# EAGLE design AL60 (EAGLE 5.11)
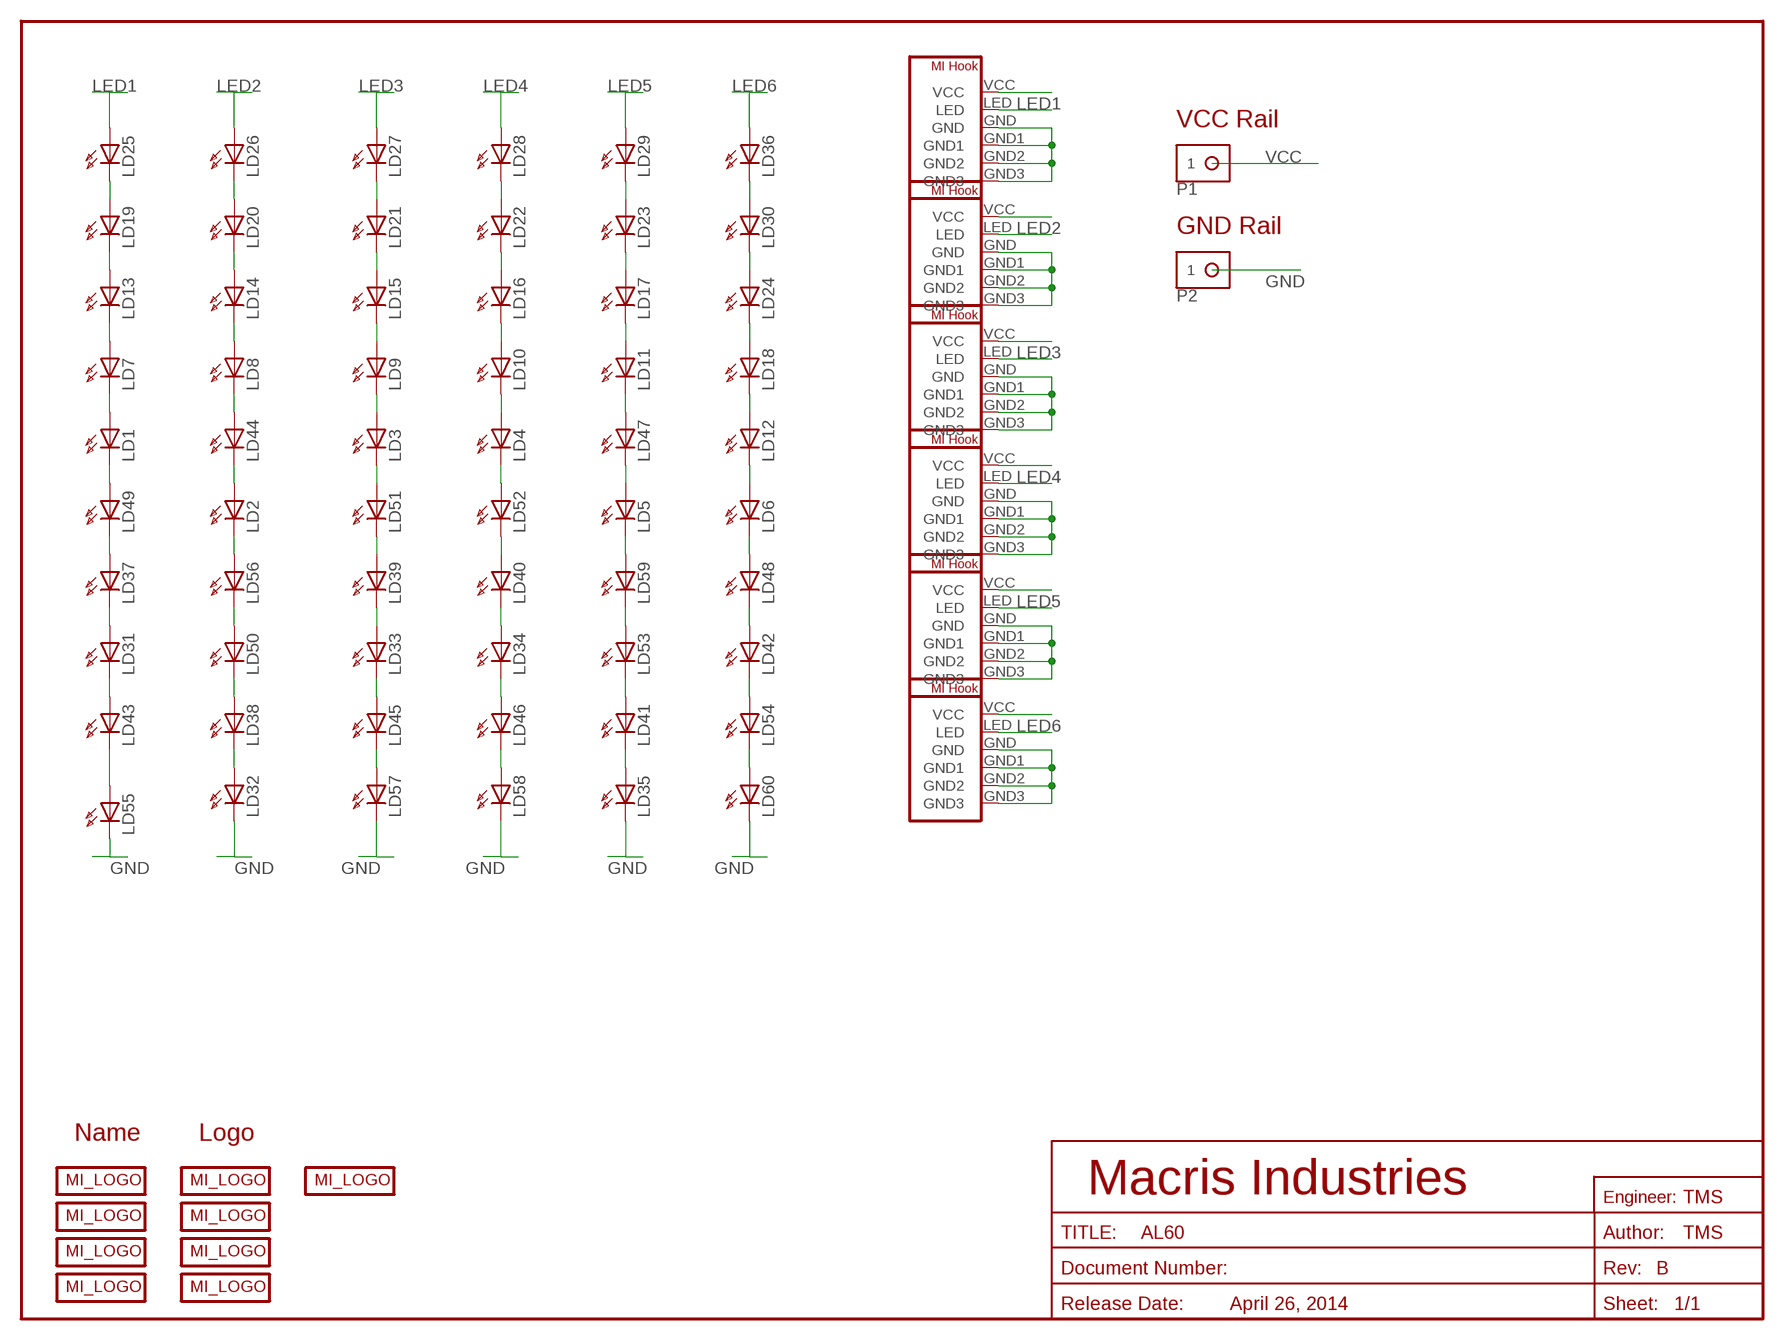
[diagram p0: schematic, sheet 1]

## Parts
LD1  LED-DS_XHB  [DS_XHB]
LD2  LED-DS_XHB  [DS_XHB]
LD3  LED-DS_XHB  [DS_XHB]
LD4  LED-DS_XHB  [DS_XHB]
LD5  LED-DS_XHB  [DS_XHB]
LD6  LED-DS_XHB  [DS_XHB]
LD7  LED-DS_XHB  [DS_XHB]
LD8  LED-DS_XHB  [DS_XHB]
LD9  LED-DS_XHB  [DS_XHB]
LD10  LED-DS_XHB  [DS_XHB]
LD11  LED-DS_XHB  [DS_XHB]
LD12  LED-DS_XHB  [DS_XHB]
LD13  LED-DS_XHB  [DS_XHB]
LD14  LED-DS_XHB  [DS_XHB]
LD15  LED-DS_XHB  [DS_XHB]
LD16  LED-DS_XHB  [DS_XHB]
LD17  LED-DS_XHB  [DS_XHB]
LD18  LED-DS_XHB  [DS_XHB]
LD19  LED-DS_XHB  [DS_XHB]
LD20  LED-DS_XHB  [DS_XHB]
LD21  LED-DS_XHB  [DS_XHB]
LD22  LED-DS_XHB  [DS_XHB]
LD23  LED-DS_XHB  [DS_XHB]
LD24  LED-DS_XHB  [DS_XHB]
LD25  LED-DS_XHB  [DS_XHB]
LD26  LED-DS_XHB  [DS_XHB]
LD27  LED-DS_XHB  [DS_XHB]
LD28  LED-DS_XHB  [DS_XHB]
LD29  LED-DS_XHB  [DS_XHB]
LD30  LED-DS_XHB  [DS_XHB]
LD31  LED-DS_XHB  [DS_XHB]
LD32  LED-DS_XHB  [DS_XHB]
LD33  LED-DS_XHB  [DS_XHB]
LD34  LED-DS_XHB  [DS_XHB]
LD35  LED-DS_XHB  [DS_XHB]
LD36  LED-DS_XHB  [DS_XHB]
LD37  LED-DS_XHB  [DS_XHB]
LD38  LED-DS_XHB  [DS_XHB]
LD39  LED-DS_XHB  [DS_XHB]
LD40  LED-DS_XHB  [DS_XHB]
LD41  LED-DS_XHB  [DS_XHB]
LD42  LED-DS_XHB  [DS_XHB]
LD43  LED-DS_XHB  [DS_XHB]
LD44  LED-DS_XHB  [DS_XHB]
LD45  LED-DS_XHB  [DS_XHB]
LD46  LED-DS_XHB  [DS_XHB]
LD47  LED-DS_XHB  [DS_XHB]
LD48  LED-DS_XHB  [DS_XHB]
LD49  LED-DS_XHB  [DS_XHB]
LD50  LED-DS_XHB  [DS_XHB]
LD51  LED-DS_XHB  [DS_XHB]
LD52  LED-DS_XHB  [DS_XHB]
LD53  LED-DS_XHB  [DS_XHB]
LD54  LED-DS_XHB  [DS_XHB]
LD55  LED-DS_XHB  [DS_XHB]
LD56  LED-DS_XHB  [DS_XHB]
LD57  LED-DS_XHB  [DS_XHB]
LD58  LED-DS_XHB  [DS_XHB]
LD59  LED-DS_XHB  [DS_XHB]
LD60  LED-DS_XHB  [DS_XHB]
P1  PAD-10G  [PAD_10G]
P2  PAD-10G  [PAD_10G]
U$1  MI_LOGO-50MIL  MI_LOGO-NAME_TWO  [MI_LOGO_NAME_2]
U$2  MI_LOGO-2014_USA  [MACRIS_USA_LOGO]
U$3  MI_LOGO-50MIL  MI_LOGO-NAME_TWO  [MI_LOGO_NAME_2]
U$4  MI_LOGO-2014_USA  [MACRIS_USA_LOGO]
U$5  MI_LOGO-50MIL  MI_LOGO-NAME_TWO  [MI_LOGO_NAME_2]
U$6  MI_LOGO-50MIL  MI_LOGO-NAME_TWO  [MI_LOGO_NAME_2]
U$7  MI_LOGO-2014_USA  [MACRIS_USA_LOGO]
U$8  MI_LOGO-2014_USA  [MACRIS_USA_LOGO]
U$9  MI_DRIVER_HOOKUP  [MI_DRIVE_HOOKUP]
U$10  MI_DRIVER_HOOKUP  [MI_DRIVE_HOOKUP]
U$11  MI_DRIVER_HOOKUP  [MI_DRIVE_HOOKUP]
U$12  MI_DRIVER_HOOKUP  [MI_DRIVE_HOOKUP]
U$13  MI_DRIVER_HOOKUP  [MI_DRIVE_HOOKUP]
U$14  MI_DRIVER_HOOKUP  [MI_DRIVE_HOOKUP]
U$15  MI_LOGO  [MACRIS_MIU30]

## Nets
GND: LD32.CATHODE(C) LD35.CATHODE(C) LD55.CATHODE(C) LD57.CATHODE(C) LD58.CATHODE(C) LD60.CATHODE(C) P2.1 U$9.GND U$9.GND1 U$9.GND2 U$9.GND3 U$10.GND U$10.GND1 U$10.GND2 U$10.GND3 U$11.GND U$11.GND1 U$11.GND2 U$11.GND3 U$12.GND U$12.GND1 U$12.GND2 U$12.GND3 U$13.GND U$13.GND1 U$13.GND2 U$13.GND3 U$14.GND U$14.GND1 U$14.GND2 U$14.GND3
LED1: LD25.ANODE(A) U$9.LED
LED2: LD26.ANODE(A) U$10.LED
LED3: LD27.ANODE(A) U$11.LED
LED4: LD28.ANODE(A) U$12.LED
LED5: LD29.ANODE(A) U$13.LED
LED6: LD36.ANODE(A) U$14.LED
N$1: LD13.ANODE(A) LD19.CATHODE(C)
N$2: LD7.ANODE(A) LD13.CATHODE(C)
N$3: LD1.ANODE(A) LD7.CATHODE(C)
N$4: LD1.CATHODE(C) LD49.ANODE(A)
N$5: LD37.ANODE(A) LD49.CATHODE(C)
N$6: LD31.ANODE(A) LD37.CATHODE(C)
N$7: LD31.CATHODE(C) LD43.ANODE(A)
N$8: LD43.CATHODE(C) LD55.ANODE(A)
N$10: LD23.ANODE(A) LD29.CATHODE(C)
N$11: LD17.ANODE(A) LD23.CATHODE(C)
N$12: LD20.ANODE(A) LD26.CATHODE(C)
N$13: LD14.ANODE(A) LD20.CATHODE(C)
N$14: LD8.ANODE(A) LD14.CATHODE(C)
N$15: LD8.CATHODE(C) LD44.ANODE(A)
N$16: LD2.ANODE(A) LD44.CATHODE(C)
N$17: LD2.CATHODE(C) LD56.ANODE(A)
N$18: LD50.ANODE(A) LD56.CATHODE(C)
N$19: LD38.ANODE(A) LD50.CATHODE(C)
N$20: LD32.ANODE(A) LD38.CATHODE(C)
N$24: LD33.CATHODE(C) LD45.ANODE(A)
N$25: LD21.ANODE(A) LD27.CATHODE(C)
N$26: LD15.ANODE(A) LD21.CATHODE(C)
N$27: LD9.ANODE(A) LD15.CATHODE(C)
N$28: LD3.ANODE(A) LD9.CATHODE(C)
N$29: LD3.CATHODE(C) LD51.ANODE(A)
N$30: LD39.ANODE(A) LD51.CATHODE(C)
N$31: LD33.ANODE(A) LD39.CATHODE(C)
N$32: LD45.CATHODE(C) LD57.ANODE(A)
N$33: LD11.ANODE(A) LD17.CATHODE(C)
N$34: LD11.CATHODE(C) LD47.ANODE(A)
N$35: LD30.ANODE(A) LD36.CATHODE(C)
N$36: LD22.ANODE(A) LD28.CATHODE(C)
N$37: LD16.ANODE(A) LD22.CATHODE(C)
N$38: LD10.ANODE(A) LD16.CATHODE(C)
N$39: LD4.ANODE(A) LD10.CATHODE(C)
N$40: LD34.ANODE(A) LD40.CATHODE(C)
N$41: LD34.CATHODE(C) LD46.ANODE(A)
N$42: LD46.CATHODE(C) LD58.ANODE(A)
N$43: LD4.CATHODE(C) LD52.ANODE(A)
N$46: LD40.ANODE(A) LD52.CATHODE(C)
N$47: LD5.ANODE(A) LD47.CATHODE(C)
N$48: LD5.CATHODE(C) LD59.ANODE(A)
N$49: LD53.ANODE(A) LD59.CATHODE(C)
N$50: LD41.ANODE(A) LD53.CATHODE(C)
N$51: LD35.ANODE(A) LD41.CATHODE(C)
N$52: LD24.ANODE(A) LD30.CATHODE(C)
N$53: LD18.ANODE(A) LD24.CATHODE(C)
N$54: LD12.ANODE(A) LD18.CATHODE(C)
N$55: LD6.ANODE(A) LD12.CATHODE(C)
N$56: LD6.CATHODE(C) LD48.ANODE(A)
N$57: LD42.ANODE(A) LD48.CATHODE(C)
N$58: LD42.CATHODE(C) LD54.ANODE(A)
N$59: LD54.CATHODE(C) LD60.ANODE(A)
N$60: LD19.ANODE(A) LD25.CATHODE(C)
VCC: P1.1 U$9.VCC U$10.VCC U$11.VCC U$12.VCC U$13.VCC U$14.VCC

## Notes on the sheet
- VCC Rail
- GND Rail
- Name | Logo
- Macris Industries
- TMS
- TMS
- B
- April 26, 2014

## Library data of the parts
LD1-LD60 = Discrete:LED: Discrete LED
P1 P2 = Mechanical:PAD: Solder Pads
U$1-U$8 U$15 = Logo:MI_LOGO
U$9-U$14 = Mechanical:MI_DRIVER_HOOKUP

## Board
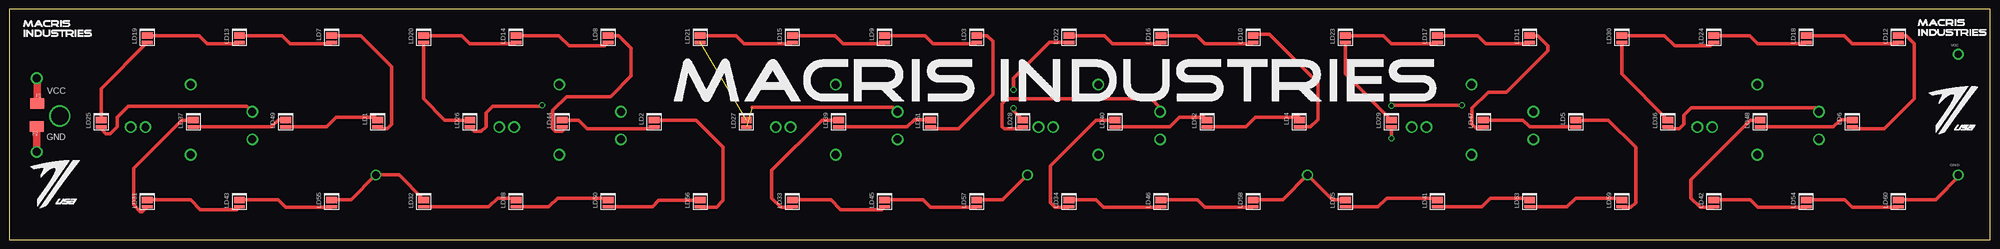
[diagram p1: board, top side]
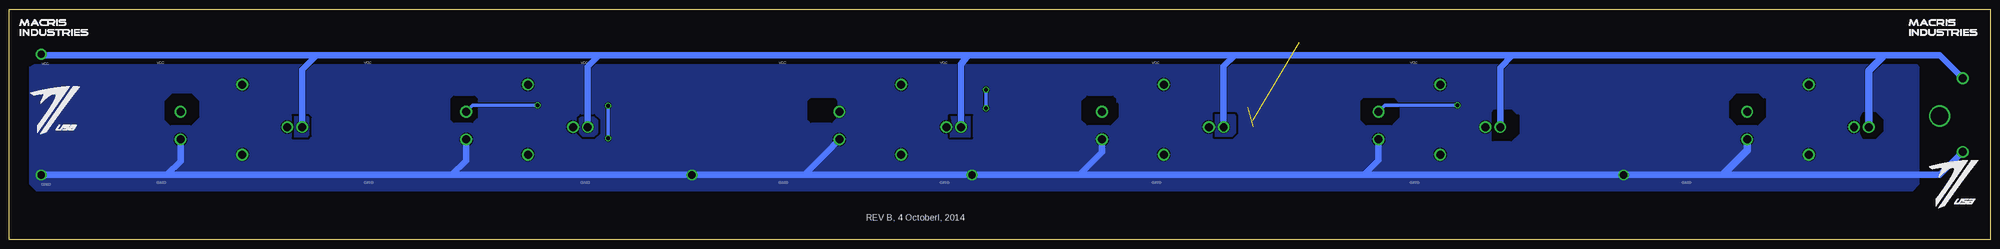
[diagram p2: board, bottom side, seen from below]

Size 546.1 x 63.5 mm. Coordinates in mm from the lower left corner, seen from the top.
Outline: 0,0 546.1,0 546.1,63.5 0,63.5 0,0
Copper layers (1*16): Top 0.0356mm / dielectric 1.5011mm / Bottom 0.0356mm
Design rules "oshPark": minimum track width 6mil, minimum drill 13mil, track to track 6mil, track to pad 6mil, pad to pad 6mil, via to via 6mil, smd to smd 6mil, copper to edge 15mil, drill to drill 6mil, minimum pad ring 7mil, minimum via ring 7mil, stop-mask expansion 4mil, vias tented up to drill 0mil, thermal gap 10mil
bRestrict: 93 lines

### Footprints (pad centres in the part's own frame; a part is rotated, then mirrored left to right if it is on the bottom)
DS_XHB = smd 0.95 x 3: ANODE 0.725,0 | smd 1.85 x 3: CATHODE -1.175,0
PAD_10G = smd 3.81 x 2.921: 1 0,0
MI_DRIVE_HOOKUP = drill 2.2 round: GND 36.576,7.264; GND1 19.558,3.048; GND2 19.558,22.352; GND3 7.112,10.668; LED 36.576,14.884; VCC 3.048,10.668

### Placement (x,y rotation side)
LD1  101.6,31.75 270 top
LD2  177.8,31.75 270 top
LD3  266.7,55.02 270 top
LD4  355.6,31.75 270 top
LD5  431.8,31.75 270 top
LD6  508,31.75 270 top
LD7  88.9,55.02 270 top
LD8  165.1,55.02 270 top
LD9  241.3,55.02 270 top
LD10  342.9,55.02 270 top
LD11  419.1,55.02 270 top
LD12  520.7,55.02 270 top
LD13  63.5,55.02 270 top
LD14  139.7,55.02 270 top
LD15  215.9,55.02 270 top
LD16  317.5,55.02 270 top
LD17  393.7,55.02 270 top
LD18  495.3,55.02 270 top
LD19  38.1,55.02 270 top
LD20  114.3,55.02 270 top
LD21  190.5,55.02 270 top
LD22  292.1,55.02 270 top
LD23  368.3,55.02 270 top
LD24  469.9,55.02 270 top
LD25  25.4,31.75 270 top
LD26  127,31.75 270 top
LD27  203.2,31.75 270 top
LD28  279.4,31.75 270 top
LD29  381,31.75 270 top
LD30  444.5,55.02 270 top
LD31  38.1,9.75 270 top
LD32  114.3,9.75 270 top
LD33  215.9,9.75 270 top
LD34  292.1,9.75 270 top
LD35  368.3,9.75 270 top
LD36  457.2,31.75 270 top
LD37  50.8,31.75 270 top
LD38  139.7,9.75 270 top
LD39  228.6,31.75 270 top
LD40  304.8,31.75 270 top
LD41  393.7,9.75 270 top
LD42  469.9,9.75 270 top
LD43  63.5,9.75 270 top
LD44  152.4,31.75 270 top
LD45  241.3,9.75 270 top
LD46  317.5,9.75 270 top
LD47  406.4,31.75 270 top
LD48  482.6,31.75 270 top
LD49  76.2,31.75 270 top
LD50  165.1,9.75 270 top
LD51  254,31.75 270 top
LD52  330.2,31.75 270 top
LD53  419.1,9.75 270 top
LD54  495.3,9.75 270 top
LD55  88.9,9.75 270 top
LD56  190.5,9.75 270 top
LD57  266.7,9.75 270 top
LD58  342.9,9.75 270 top
LD59  444.5,9.75 270 top
LD60  520.7,9.75 270 top
P1  7.75,37.47 180 top
P2  7.62,31.11 0 top
U$1  3.56,55.63 0 top
U$2  528.32,27.94 0 top
U$3  525.78,55.88 0 top
U$4  541.02,27.94 0 bottom
U$5  22.86,55.88 0 bottom
U$6  543.56,55.88 0 bottom
U$7  5.08,7.62 0 top
U$8  17.78,7.62 0 bottom
U$9  30.48,20.32 0 top
U$10  132.08,20.32 0 top
U$11  208.28,20.32 0 top
U$12  280.67,20.32 0 top
U$13  383.54,20.32 0 top
U$14  462.28,20.32 0 top
U$15  182.88,37.47 0 top

### Tracks (layer width: path | path; a pad name or v marks a point on that pad's centre or on a via)
GND  (via drill 2, 2.2 pad 2.18)
  Top 1.016: LD55.CATHODE 94.24,10.93 v101.09,17.78 107.45,17.78 LD32.CATHODE | LD57.CATHODE 273.82,10.93 v280.67,17.78 | LD58.CATHODE 351.04,10.93 v357.89,17.78 364.74,10.93 LD35.CATHODE | LD60.CATHODE 530.99,10.93 537.85,17.78 v537.21,17.78
  Top 2.032: v7.62,24.13 P2.1
  Bottom 1.778: v7.62,24.13 13.97,17.78 73.91,17.78 | 73.91,17.78 v101.09,17.78 172.72,17.78 | 326.9,17.78 v280.67,17.78 251.08,17.78 | 326.9,17.78 v357.89,17.78 424.05,17.78 | 251.08,17.78 172.72,17.78 | 502.67,17.78 424.05,17.78 | 502.67,17.78 v537.21,17.78 | 73.91,17.78 73.41,18.29 | U$10.GND 168.66,21.84 172.72,17.78 | U$11.GND 244.86,24 251.08,17.78 | U$12.GND 321.06,23.62 326.9,17.78 | U$13.GND 420.12,21.72 424.05,17.78 | U$14.GND 498.86,21.59 502.67,17.78
  Bottom 2.032: U$9.GND 67.06,24.64 73.41,18.29
  pour Bottom: 20.32,48.26 19.68,47.62 19.68,15.24 21.59,13.34 538.48,13.34 540.38,15.24 540.38,47.62 539.12,48.26
LED1
  Top 1.016: U$9.LED 65.56,36.7 32.89,36.7 29.84,33.66 29.84,31.11 27.94,29.21 26.67,29.21 25.4,30.48 LD25.ANODE
LED2  (via drill 1.1)
  Top 1.016: v146.94,36.96 146.69,36.7 133.22,36.7 131.44,34.92 131.44,31.11 130.18,29.84 128.18,29.84 LD26.ANODE
  Bottom 1.016: v146.94,36.96 166.9,36.96 U$10.LED
LED3  (1 unrouted)
  Top 1.016: 204.72,36.45 243.61,36.45 U$11.LED
LED4
  Top 1.016: U$12.LED 317.25,36.32 314.83,38.73 274.95,38.73 273.69,37.47 273.69,31.11 274.32,30.48 278.86,30.48 LD28.ANODE
LED5  (via drill 1.1)
  Top 1.016: v400.43,36.96 381.51,36.96 v381,36.83 | v381,27.94 LD29.ANODE
  Bottom 1.016: v400.43,36.96 418.36,36.96 U$13.LED | v381,27.94 v381,36.83
LED6
  Top 1.016: U$14.LED 497.74,36.32 463.68,36.32 461.64,34.29 461.64,31.75 460.38,30.48 457.75,30.48 LD36.ANODE
N$1
  Top 1.016: LD19.CATHODE 52.39,56.19 54.61,53.98 63.18,53.98 LD13.ANODE
N$2
  Top 1.016: LD13.CATHODE 75.25,56.19 77.47,53.98 88.58,53.98 LD7.ANODE
N$3
  Top 1.016: LD7.CATHODE 96.84,56.19 105.41,47.62 105.41,31.75 104.14,30.48 102.14,30.48 LD1.ANODE
N$4
  Top 1.016: LD49.ANODE 87.54,31.02 90.17,33.66 100.87,33.66 LD1.CATHODE
N$5
  Top 1.016: LD37.ANODE 72.3,31.02 74.3,33.02 76.11,33.02 LD49.CATHODE
N$6
  Top 1.016: LD37.CATHODE 47.53,32.92 34.29,19.68 34.29,9.53 36.2,7.62 36.69,7.62 LD31.ANODE
N$7
  Top 1.016: LD31.CATHODE 50.03,10.93 52.7,8.26 62.73,8.26 LD43.ANODE
N$8
  Top 1.016: LD43.CATHODE 74.16,10.93 76.2,8.89 88.76,8.89 LD55.ANODE
N$10
  Top 1.016: LD23.ANODE 368.3,45.62 LD29.CATHODE
N$11
  Top 1.016: LD23.CATHODE 378.78,56.19 381,53.98 393.38,53.98 LD17.ANODE
N$12
  Top 1.016: LD26.CATHODE 120.11,32.92 114.3,38.73 LD20.ANODE
N$13
  Top 1.016: LD20.CATHODE 124.78,56.19 127,53.98 139.38,53.98 LD14.ANODE
N$14
  Top 1.016: LD14.CATHODE 151.45,56.19 154.31,53.34 164.15,53.34 LD8.ANODE
N$15
  Top 1.016: LD8.CATHODE 167.96,56.19 171.45,52.7 171.45,45.09 165.74,39.37 153.67,39.37 149.86,35.56 149.86,30.48 150.5,29.84 152.4,29.84 153.03,30.48 152.94,30.48 LD44.ANODE
N$16
  Top 1.016: LD44.CATHODE 156.94,32.92 159.38,30.48 177.25,30.48 LD2.ANODE
N$17
  Top 1.016: LD2.CATHODE 189.32,32.92 196.85,25.4 196.85,10.79 194.94,8.89 190.64,8.89 LD56.ANODE
N$18
  Top 1.016: LD50.ANODE 177.3,9.03 179.07,10.79 190.37,10.79 LD56.CATHODE
N$19
  Top 1.016: LD38.ANODE 148.73,9.03 151.13,11.43 164.6,11.43 LD50.CATHODE
N$20
  Top 1.016: LD32.ANODE 132.22,9.03 134.62,11.43 139.2,11.43 LD38.CATHODE
N$21  (via drill 4.83 pad 5.08)
  other vias: 13.97,34.04
N$24
  Top 1.016: LD33.CATHODE 226.56,10.93 229.24,8.26 240.53,8.26 LD45.ANODE
N$25  (1 unrouted)
N$26
  Top 1.016: LD21.CATHODE 200.35,56.19 202.56,53.98 215.58,53.98 LD15.ANODE
N$27
  Top 1.016: LD15.CATHODE 227.65,56.19 229.87,53.98 240.98,53.98 LD9.ANODE
N$28
  Top 1.016: LD9.CATHODE 252.42,56.19 254.63,53.98 266.38,53.98 LD3.ANODE
N$29
  Top 1.016: LD3.CATHODE 269.56,56.19 271.14,54.61 271.14,40.01 261.62,30.48 254.54,30.48 LD51.ANODE
N$30
  Top 1.016: LD39.ANODE 247.56,31.02 249.56,33.02 253.91,33.02 LD51.CATHODE
N$31
  Top 1.016: LD39.CATHODE 224.06,32.92 210.19,19.05 210.19,11.43 212.72,8.89 215.76,8.89 LD33.ANODE
N$32
  Top 1.016: LD45.CATHODE 251.96,10.93 254,8.89 266.56,8.89 LD57.ANODE
N$33
  Top 1.016: LD17.CATHODE 404.82,56.19 407.04,53.98 418.78,53.98 LD11.ANODE
N$34
  Top 1.016: LD11.CATHODE 421.33,56.19 424.18,53.34 424.18,52.07 412.75,40.64 407.67,40.64 403.23,36.2 403.23,31.75 404.5,30.48 405.86,30.48 LD47.ANODE
N$35
  Top 1.016: LD30.ANODE 444.5,45.62 LD36.CATHODE
N$36  (via drill 1.1)
  Top 1.016: LD22.ANODE 286.7,54.29 276.86,44.45 v276.86,41.27 | v276.86,36.2 276.86,35.47 LD28.CATHODE
  Bottom 1.016: v276.86,36.2 v276.86,41.27
N$37
  Top 1.016: LD22.CATHODE 301.95,56.19 304.17,53.98 317.18,53.98 LD16.ANODE
N$38
  Top 1.016: LD16.CATHODE 327.35,56.19 329.56,53.98 342.58,53.98 LD10.ANODE
N$39
  Top 1.016: LD4.ANODE 358.69,31.02 360.68,33.02 360.68,43.18 347.35,56.52 344.17,56.52 343.54,55.88 343.21,55.88 LD10.CATHODE
N$40
  Top 1.016: LD40.CATHODE 299.62,32.92 287.02,20.32 287.02,10.16 288.29,8.89 291.96,8.89 LD34.ANODE
N$41
  Top 1.016: LD34.CATHODE 299.59,10.93 301.62,8.89 317.36,8.89 LD46.ANODE
N$42
  Top 1.016: LD46.CATHODE 327.53,10.93 329.56,8.89 342.76,8.89 LD58.ANODE
N$43
  Top 1.016: LD52.ANODE 340.9,31.02 343.54,33.66 355.6,33.66 356.24,33.02 355.69,33.02 LD4.CATHODE
N$46
  Top 1.016: LD40.ANODE 319.95,31.02 322.58,33.66 329.47,33.66 LD52.CATHODE
N$47
  Top 1.016: LD47.CATHODE 417.29,32.92 419.1,31.11 431.71,31.11 LD5.ANODE
N$48
  Top 1.016: LD5.CATHODE 440.79,32.92 448.31,25.4 448.31,10.16 447.04,8.89 444.64,8.89 LD59.ANODE
N$49
  Top 1.016: LD53.ANODE 429.4,9.03 431.8,11.43 444,11.43 LD59.CATHODE
N$50
  Top 1.016: LD41.ANODE 405.9,9.03 408.31,11.43 418.6,11.43 LD53.CATHODE
N$51
  Top 1.016: LD35.ANODE 377.33,9.03 379.73,11.43 394.2,11.43 | 394.2,11.43 394.33,11.43 | 394.2,11.43 LD41.CATHODE
N$52
  Top 1.016: LD30.CATHODE 456.25,56.19 459.11,53.34 468.95,53.34 LD24.ANODE
N$53
  Top 1.016: LD24.CATHODE 479.75,56.19 481.96,53.98 494.98,53.98 LD18.ANODE
N$54
  Top 1.016: LD18.CATHODE 505.78,56.19 508,53.98 520.38,53.98 LD12.ANODE
N$55
  Top 1.016: LD12.CATHODE 522.93,56.19 525.14,53.98 525.14,38.73 516.89,30.48 508.55,30.48 LD6.ANODE
N$56
  Top 1.016: LD48.ANODE 502.83,31.02 504.82,33.02 507.9,33.02 LD6.CATHODE
N$57
  Top 1.016: LD48.CATHODE 479.96,32.92 463.55,16.51 463.55,11.43 466.09,8.89 469.76,8.89 LD42.ANODE
N$58
  Top 1.016: LD42.CATHODE 479.93,10.93 481.96,8.89 495.16,8.89 LD54.ANODE
N$59
  Top 1.016: LD54.CATHODE 505.96,10.93 508,8.89 520.56,8.89 LD60.ANODE
N$60
  Top 1.016: LD25.CATHODE 25.4,41.59 LD19.ANODE
VCC  (via drill 2, 2.2 pad 2.18)
  Top 2.032: P1.1 7.75,44.32 v7.62,44.45
  Bottom 0.61: 537.21,50.8 v537.21,51.05
  Bottom 1.016: 29.84,50.8 29.84,50.16
  Bottom 1.778: v7.62,44.45 13.97,50.8 29.84,50.8 131.7,50.8 | 208.28,50.8 131.7,50.8 | 281.81,50.8 208.28,50.8 | 383.41,50.8 281.81,50.8 | 461.26,50.8 383.41,50.8 | 461.26,50.8 537.21,50.8 | U$10.VCC 135.13,47.37 131.7,50.8 | U$11.VCC 211.33,47.75 208.28,50.8 | U$12.VCC 283.72,48.26 281.81,50.8 | U$13.VCC 386.59,47.62 383.41,50.8 | U$14.VCC 465.33,46.74 461.26,50.8
  Bottom 2.032: U$9.VCC 33.53,46.48 29.84,50.16

### Text on the board
bPlace: REV B, 4 Octoberl, 2014
tNames: VCC | VCC | GND | GND
bNames: VCC | VCC | VCC | VCC | VCC | VCC | VCC | VCC | GND | GND | GND | GND | GND | GND | GND | GND | GND
Document: 21.50" | .866" | 2.5" | .384" | 1.0"